# Altium schematic sheet Sheet1.SchDoc
size 420 x 297 mm; SheetNumber: 1; SheetTotal: 1; GOST_Number: {Number}; GOST_DocumentNameLine1: {DocumentNameLine1}; GOST_Engineer: {Engineer}; GOST_Checker: {Checker}; GOST_TechControl: {TechControl}; GOST_NormControl: {NormControl}; GOST_Approver: {Approver}; GOST_Company: {Company}; GOST_DocumentNameLine2: {DocumentNameLine2}; GOST_DocumentNameLine3: {DocumentNameLine3}; GOST_DocumentNameLine4: {DocumentNameLine4}
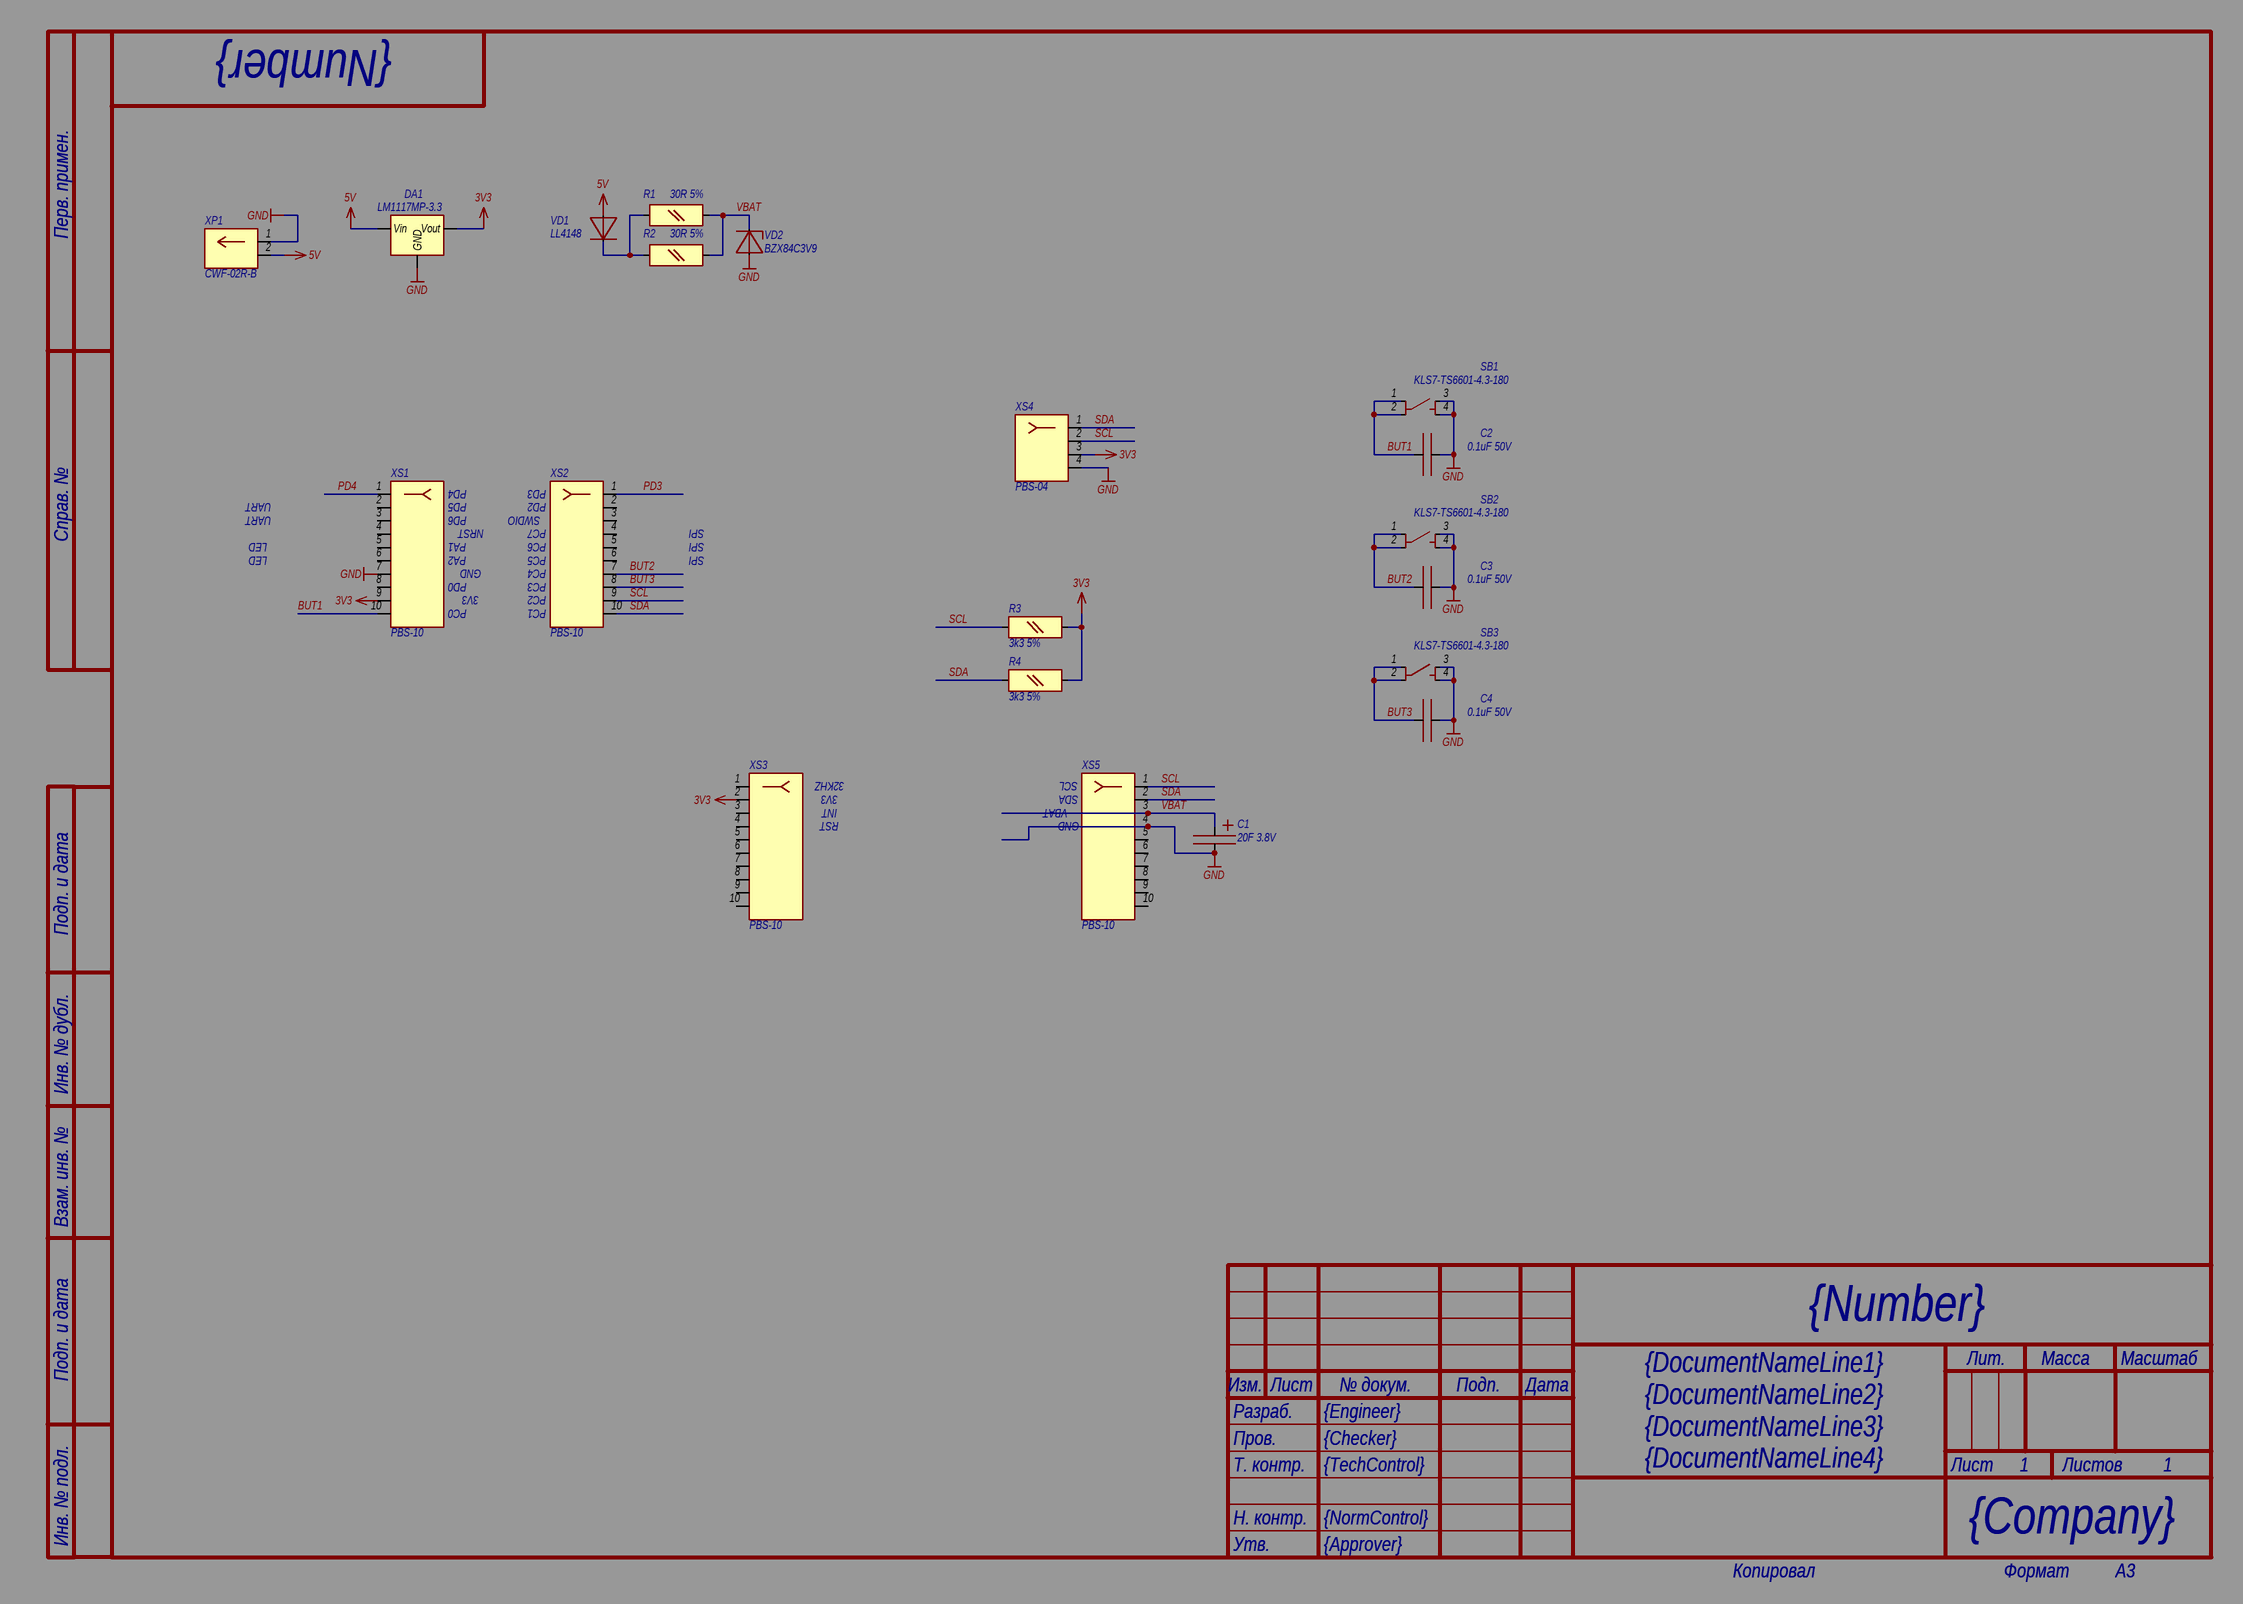
[diagram p0: Sheet1.SchDoc]

## Parts
C1  20F 3.8V  [LIC0813]
C2  0.1uF 50V  [CAP SMD0805]
C3  0.1uF 50V  [CAP SMD0805]
C4  0.1uF 50V  [CAP SMD0805]
DA1  LM1117MP-3.3  [SOT223]
R1  30R 5%  [SMD 0805]
R2  30R 5%  [SMD 0805]
R3  3k3 5%  [SMD 0805]
R4  3k3 5%  [SMD 0805]
SB1  KLS7-TS6601-4.3-180  [KLS7-TS6601-4.3-180]
SB2  KLS7-TS6601-4.3-180  [KLS7-TS6601-4.3-180]
SB3  KLS7-TS6601-4.3-180  [KLS7-TS6601-4.3-180]
VD1  LL4148  [MINIMELF]
VD2  BZX84C3V9  [SOT23_1A3C]
XP1  CWF-02R-B  [CWF-02R-B]
XS1  PBS-10  [PBS-10]
XS2  PBS-10  [PBS-10]
XS3  PBS-10  [PBS-10]
XS4  PBS-04  [PBS-04]
XS5  PBS-10  [PBS-10]

## Nets
3V3: DA1.2(Vout) R3.2 R4.2 XS1.9 XS3.2 XS4.3
5V: DA1.3(Vin) VD1.A XP1.2
GND: C1.2 C2.2 C3.2 C4.2 DA1.1(GND) SB1.3 SB1.4 SB2.3 SB2.4 SB3.3 SB3.4 VD2.A XP1.1 XS1.7 XS4.4 XS5.4
BUT1: C2.1 SB1.1 SB1.2 XS1.10
BUT2: C3.1 SB2.1 SB2.2 XS2.7
BUT3: C4.1 SB3.1 SB3.2 XS2.8
PD3: XS2.1
PD4: XS1.1
SCL: R3.1 XS2.9 XS4.2 XS5.1
SDA: R4.1 XS2.10 XS4.1 XS5.2
VBAT: C1.1 R1.2 R2.2 VD2.C XS5.3
NetR1_1: R1.1 R2.1 VD1.C

Not connected (* = marked no-connect by the designer): XS1 2 3 4 5 6 8; XS2 2 3 4 5 6; XS3 1 3 4 5 6 7 8 9 10; XS5 5 6 7 8 9 10

## Notes on the sheet
- Перв. примен.
- UART
- PD4
- PD5
- PD6
- NRST
- SWDIO
- PD2
- PD3
- PC7
- SPI
- Справ. №
- LED
- PD0
- PA1
- PA2
- 3V3
- GND
- PC2
- PC3
- PC4
- PC5
- PC6
- PC0
- PC1
- 32KHZ
- SDA
- SCL
- INT
- RST
- VBAT
- Подп. и дата
- Инв. № дубл.
- Взам. инв. №
- Изм.
- Лист
- № докум.
- Подп.
- Дата
- Лит.
- Масса
- Масштаб
- Разраб.
- Пров.
- Т. контр.
- Листов
- Инв. № подл.
- Н. контр.
- Утв.
- Копировал
- Формат
- А3

## Library data of the parts
C1 = LIC 0813 206: Ионистор 20F 3.8V 0813; Код: 15; Value: 20F 3.8V; Part Number: LIC 0813 206; Class: Ионистор
C2-C4 = Cap 0805 0.1uF 50V: Конденсатор керамический SMD 0805 0.1uF 50V ±20%; Код: 42; Class: Конденсатор неполярный SMD; Value: 0.1uF 50V; Part Number: Cap 0805 0.1uF 50V
DA1 = LM1117MP-3.3: LDO стабилизатор; Код: 137; Class: Микросхема; Value: LM1117MP-3.3; Part Number: LM1117MP-3.3
R1 R2 = Res 0805 30R 5%: Резистор SMD 0805 30R 5%; Код: 1192; Value: 30R 5%; Part Number: Res 0805 30R 5%; Class: Резистор SMD
R3 R4 = Res 0805 3k3 5%: Резистор SMD 0805 3k3 5%; Код: 1241; Value: 3k3 5%; Part Number: Res 0805 3k3 5%; Class: Резистор SMD
SB1-SB3 = KLS7-TS6601-4.3-180: Кнопка тактовая KLS7-TS6601 6х6х4,3мм; Код: 2; Value: KLS7-TS6601-4.3-180; Part Number: KLS7-TS6601-4.3-180; Class: Кнопка тактовая
VD1 = LL4148: Диод LL4148; Код: 12; Class: Диоды; Value: LL4148; Part Number: LL4148
VD2 = BZX84C3V9: Стабилитрон BZX84C3V9 SOT23; Код: 6; Class: Стабилитроны; Value: BZX84C3V9; Part Number: BZX84C3V9
XP1 = CWF-02R-B: Разъём CWF-02R-B вилка угловая 2,50мм тип B; Код: 346; Value: CWF-02R-B; Part Number: CWF-02R-B; Class: Разъём; Поле9: вилка угловая 2,50мм тип B
XS1-XS3 XS5 = PBS-10: Разъём PBS-10 гнездо однорядное 2,54мм; Код: 126; Value: PBS-10; Part Number: PBS-10; Class: Разъём; Поле9: гнездо однорядное 2,54мм
XS4 = PBS-04: Разъём PBS-04 гнездо однорядное 2,54мм; Код: 120; Value: PBS-04; Part Number: PBS-04; Class: Разъём; Поле9: гнездо однорядное 2,54мм